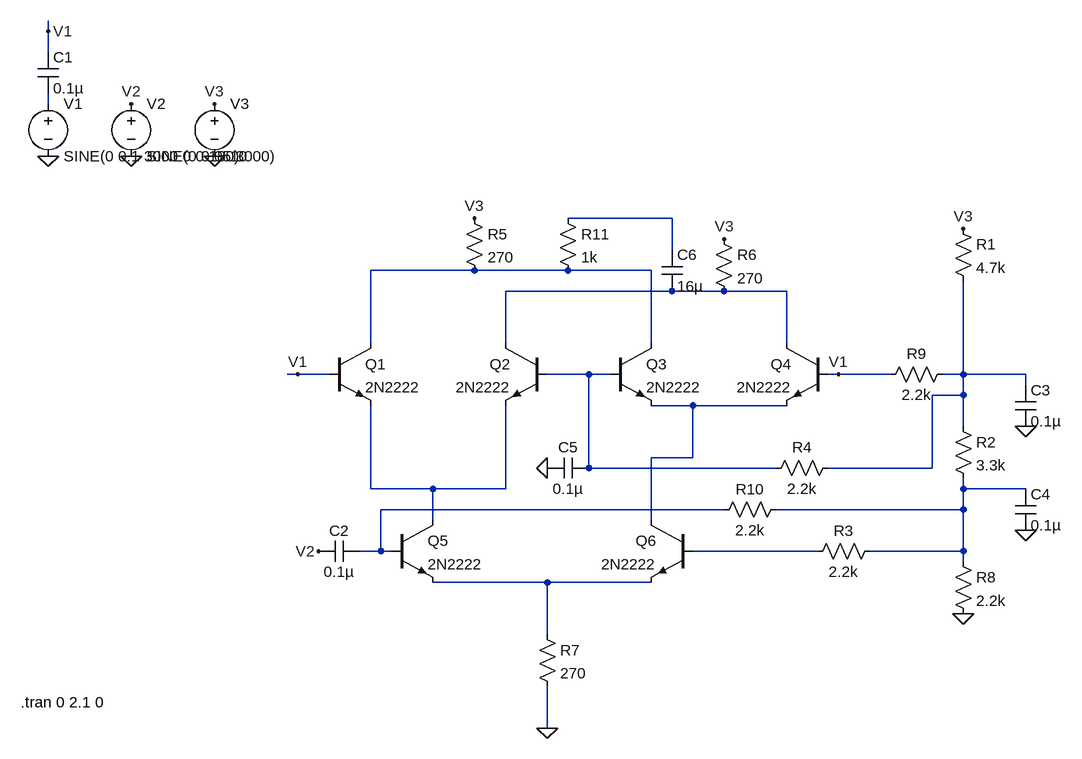
[diagram p0: schematic gilber_cell.asc]
gilber_cell.asc, the LTspice schematic file:
Version 4
SHEET 1 1132 724
WIRE -432 -368 -432 -384
WIRE -432 -336 -432 -368
WIRE -432 -256 -432 -272
WIRE 528 -80 368 -80
WIRE 528 -32 528 -80
WIRE 224 0 64 0
WIRE 368 0 224 0
WIRE 496 0 368 0
WIRE 528 32 272 32
WIRE 608 32 528 32
WIRE 704 32 608 32
WIRE 64 112 64 0
WIRE 272 112 272 32
WIRE 496 112 496 0
WIRE 704 112 704 32
WIRE -48 160 -64 160
WIRE 0 160 -48 160
WIRE 400 160 336 160
WIRE 432 160 400 160
WIRE 784 160 768 160
WIRE 864 160 784 160
WIRE 976 160 976 16
WIRE 976 160 944 160
WIRE 1072 160 976 160
WIRE 1072 176 1072 160
WIRE 976 192 976 160
WIRE 976 192 928 192
WIRE 560 208 496 208
WIRE 704 208 560 208
WIRE 976 240 976 192
WIRE 560 288 560 208
WIRE 560 288 496 288
WIRE 400 304 400 160
WIRE 688 304 400 304
WIRE 928 304 928 192
WIRE 928 304 768 304
WIRE 64 336 64 208
WIRE 160 336 64 336
WIRE 272 336 272 208
WIRE 272 336 160 336
WIRE 976 336 976 320
WIRE 1072 336 976 336
WIRE 608 368 80 368
WIRE 976 368 976 336
WIRE 976 368 688 368
WIRE 160 384 160 336
WIRE 496 384 496 288
WIRE 80 432 80 368
WIRE 80 432 48 432
WIRE 96 432 80 432
WIRE 752 432 560 432
WIRE 976 432 976 368
WIRE 976 432 832 432
WIRE 976 448 976 432
WIRE 336 480 160 480
WIRE 496 480 336 480
WIRE 336 560 336 480
WIRE 336 704 336 640
FLAG -432 -176 0
FLAG -304 -176 0
FLAG -176 -176 0
FLAG -304 -256 V2
FLAG -176 -256 V3
FLAG -432 -368 V1
FLAG -48 160 V1
FLAG -16 432 V2
FLAG 224 -80 V3
FLAG 608 -48 V3
FLAG 336 704 0
FLAG 784 160 V1
FLAG 976 528 0
FLAG 976 -64 V3
FLAG 1072 240 0
FLAG 1072 400 0
FLAG 336 304 0
SYMBOL npn 0 112 R0
SYMATTR InstName Q1
SYMATTR Value 2N2222
SYMBOL npn 336 112 M0
SYMATTR InstName Q2
SYMATTR Value 2N2222
SYMBOL npn 432 112 R0
SYMATTR InstName Q3
SYMATTR Value 2N2222
SYMBOL npn 768 112 M0
SYMATTR InstName Q4
SYMATTR Value 2N2222
SYMBOL npn 96 384 R0
SYMATTR InstName Q5
SYMATTR Value 2N2222
SYMBOL npn 560 384 M0
SYMATTR InstName Q6
SYMATTR Value 2N2222
SYMBOL voltage -432 -272 R0
WINDOW 123 0 0 Left 0
WINDOW 39 0 0 Left 0
SYMATTR InstName V1
SYMATTR Value SINE(0 0.1 3000 0 0 180)
SYMBOL voltage -304 -272 R0
WINDOW 123 0 0 Left 0
WINDOW 39 0 0 Left 0
SYMATTR InstName V2
SYMATTR Value SINE(0 0.05 3000)
SYMBOL voltage -176 -272 R0
WINDOW 123 0 0 Left 0
WINDOW 39 0 0 Left 0
SYMATTR InstName V3
SYMATTR Value 10
SYMBOL cap 48 416 R90
WINDOW 0 0 32 VBottom 2
WINDOW 3 32 32 VTop 2
SYMATTR InstName C2
SYMATTR Value 0.1µ
SYMBOL cap -448 -336 R0
SYMATTR InstName C1
SYMATTR Value 0.1µ
SYMBOL res 208 -96 R0
SYMATTR InstName R5
SYMATTR Value 270
SYMBOL res 592 -64 R0
SYMATTR InstName R6
SYMATTR Value 270
SYMBOL res 320 544 R0
SYMATTR InstName R7
SYMATTR Value 270
SYMBOL res 960 224 R0
SYMATTR InstName R2
SYMATTR Value 3.3k
SYMBOL res 960 432 R0
SYMATTR InstName R8
SYMATTR Value 2.2k
SYMBOL res 848 416 R90
WINDOW 0 0 56 VBottom 2
WINDOW 3 32 56 VTop 2
SYMATTR InstName R3
SYMATTR Value 2.2k
SYMBOL res 960 -80 R0
SYMATTR InstName R1
SYMATTR Value 4.7k
SYMBOL res 784 288 R90
WINDOW 0 0 56 VBottom 2
WINDOW 3 32 56 VTop 2
SYMATTR InstName R4
SYMATTR Value 2.2k
SYMBOL res 960 144 R90
WINDOW 0 0 56 VBottom 2
WINDOW 3 32 56 VTop 2
SYMATTR InstName R9
SYMATTR Value 2.2k
SYMBOL cap 1056 176 R0
SYMATTR InstName C3
SYMATTR Value 0.1µ
SYMBOL cap 1056 336 R0
SYMATTR InstName C4
SYMATTR Value 0.1µ
SYMBOL cap 400 288 R90
WINDOW 0 0 32 VBottom 2
WINDOW 3 32 32 VTop 2
SYMATTR InstName C5
SYMATTR Value 0.1µ
SYMBOL res 704 352 R90
WINDOW 0 0 56 VBottom 2
WINDOW 3 32 56 VTop 2
SYMATTR InstName R10
SYMATTR Value 2.2k
SYMBOL res 352 -96 R0
SYMATTR InstName R11
SYMATTR Value 1k
SYMBOL cap 512 -32 R0
SYMATTR InstName C6
SYMATTR Value 16µ
TEXT -474 664 Left 2 !.tran 0 2.1 0

The netlist it stands for:
* gilber_cell.asc
Q1 N003 V1 N008 0 2N2222
Q2 N004 N005 N008 0 2N2222
Q3 N003 N005 N007 0 2N2222
Q4 N004 V1 N007 0 2N2222
Q5 N008 N010 N012 0 2N2222
Q6 N007 N011 N012 0 2N2222
V1 N001 0 SINE(0 0.1 3000 0 0 180)
V2 V2 0 SINE(0 0.05 3000)
V3 V3 0 10
C2 N010 V2 0.1µ
C1 V1 N001 0.1µ
R5 V3 N003 270
R6 V3 N004 270
R7 N012 0 270
R2 N006 N009 3.3k
R8 N009 0 2.2k
R3 N009 N011 2.2k
R1 V3 N006 4.7k
R4 N006 N005 2.2k
R9 N006 V1 2.2k
C3 N006 0 0.1µ
C4 N009 0 0.1µ
C5 N005 0 0.1µ
R10 N009 N010 2.2k
R11 N002 N003 1k
C6 N002 N004 16µ
.model NPN NPN
.model PNP PNP
.lib standard.bjt
.tran 0 2.1 0
.backanno
.end